# EAGLE schematic Flash2Verify_v1.0 (EAGLE 6.4)
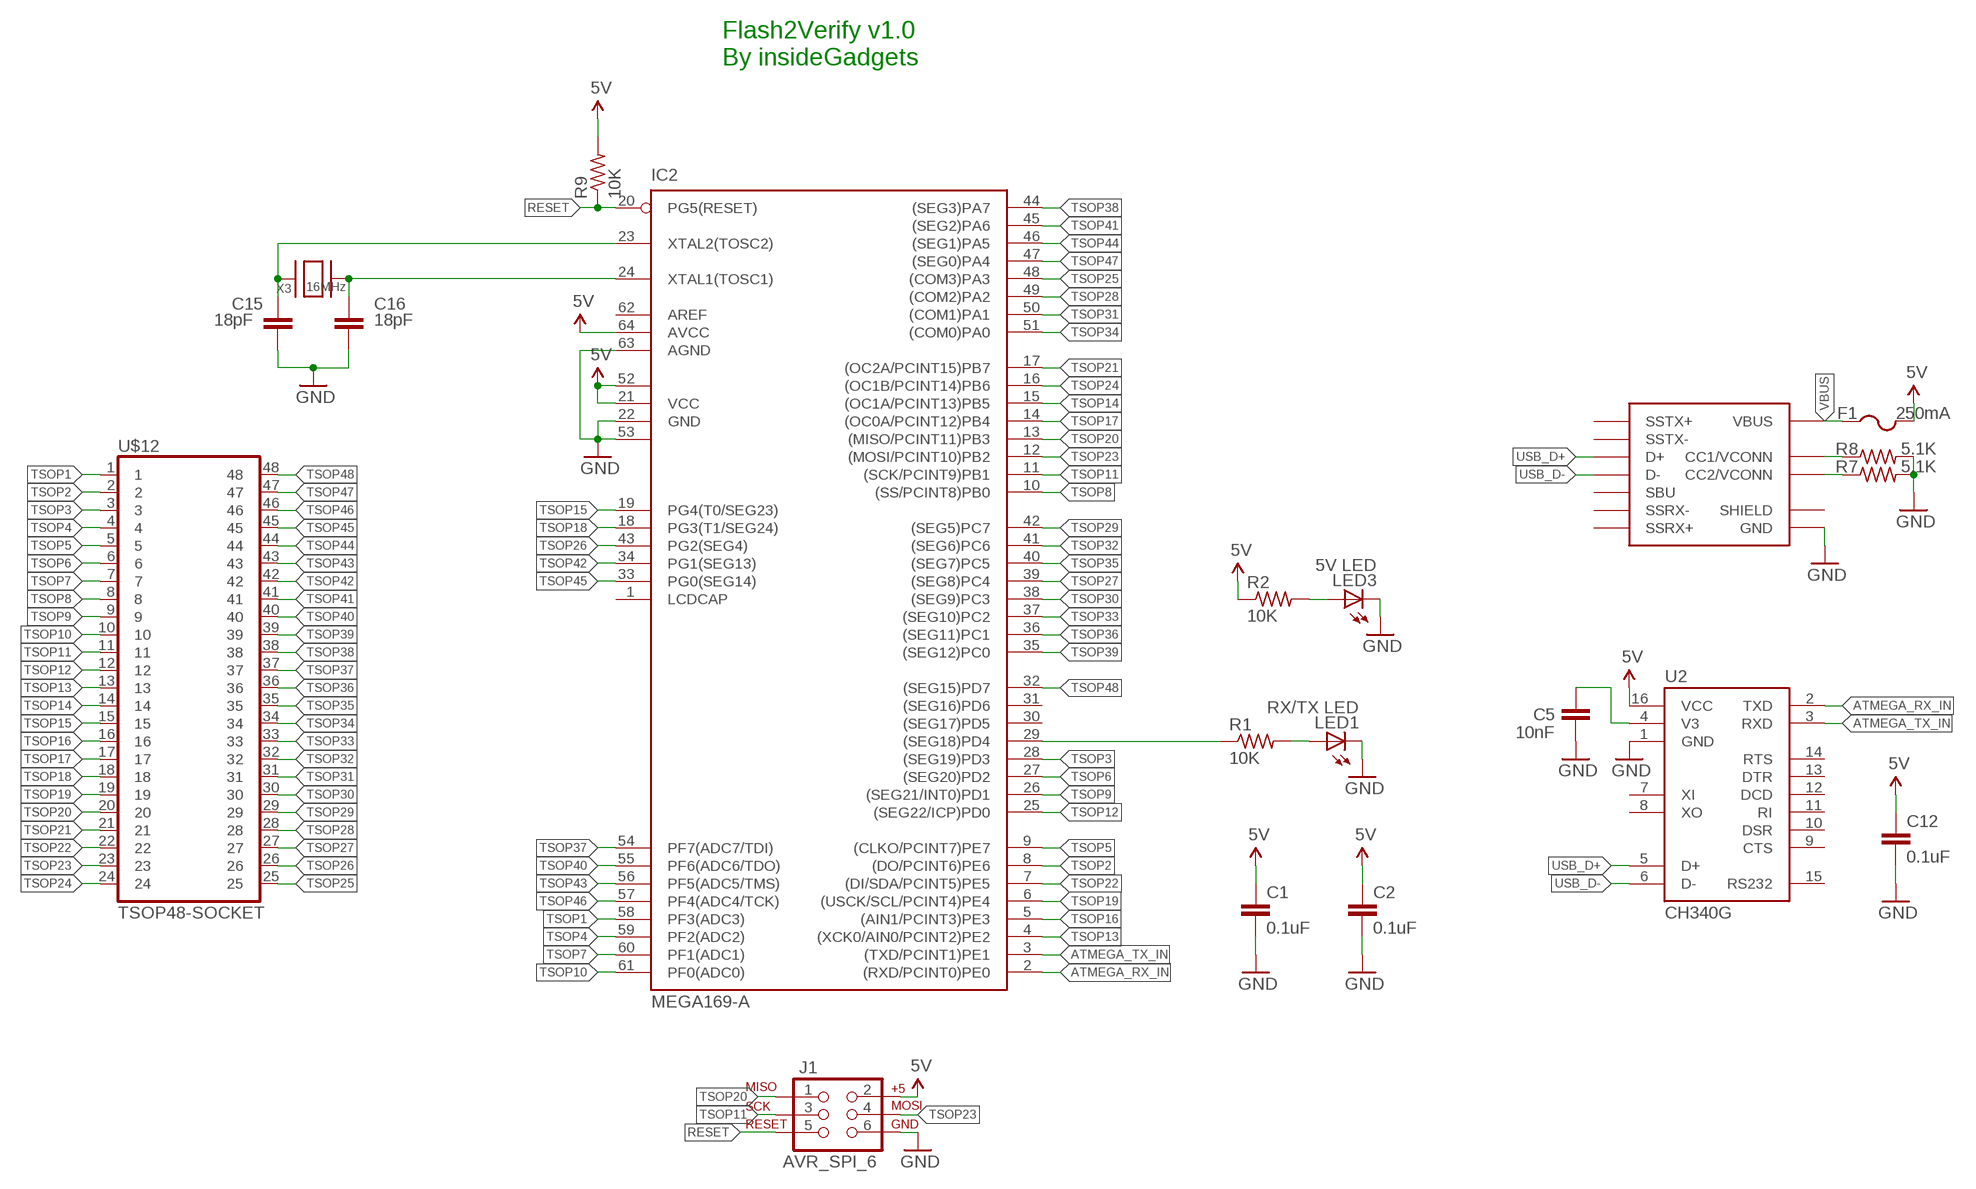
[diagram p0: schematic, sheet 1]

## Parts
C1  0.1uF  CAP0805  [C0805K]
C2  0.1uF  CAP0805  [C0805K]
C5  10nF  CAP0805  [C0805K]
C12  0.1uF  CAP0805  [C0805K]
C15  18pF  CAP0603  [C0603K]
C16  18pF  CAP0603  [C0603K]
F1  250mA  PTCFUSE-1206  [R1206]
IC2  MEGA169-A  [TQFP64]
J1  AVR_SPI_6  AVR_SPI_PRG_6  [2X3_2]
LED1  RX/TX LED  LEDCHIP-LED0805-NS  [CHIP-LED0805-NS]
LED3  5V LED  LEDCHIP-LED0805-NS  [CHIP-LED0805-NS]
R1  10K  R-US_R0805_2  [R0805_2]
R2  10K  R-US_R0805_2  [R0805_2]
R7  5.1K  R-US_R0805_2  [R0805_2]
R8  5.1K  R-US_R0805_2  [R0805_2]
R9  10K  R-US_R0805_2  [R0805_2]
U2  CH340G  [SO16]
U$3  USB-TYPE-CC393939  [USB-TYPE-C-C393939]
U$12  TSOP48-SOCKET  [TSOP48-SOCKET]
X3  16MHz  XTAL3.2X2.5  [XTAL32-25]

## Nets
5V: C1.1 C2.1 C12.1 F1.2 IC2.21(VCC) IC2.52(VCC1) IC2.64(AVCC) J1.2 R2.1 R9.2 U2.16(VCC)
ATMEGA_RX_IN: IC2.2((RXD/PCINT0)PE0) U2.2(TXD)
ATMEGA_TX_IN: IC2.3((TXD/PCINT1)PE1) U2.3(RXD)
GND: C1.2 C2.2 C5.2 C12.2 C15.2 C16.2 IC2.22(GND) IC2.53(GND1) IC2.63(AGND) J1.6 LED1.C LED3.C R7.2 R8.2 U2.1(GND) U$3.1(GND) U$3.12(GND)
N$1: R7.1 U$3.10(CC2/VCONN)
N$2: IC2.29((SEG18)PD4) R1.1
N$5: LED3.A R2.2
N$7: R8.1 U$3.4(CC1/VCONN)
N$18: LED1.A R1.2
RESET: IC2.20(PG5(RESET)) J1.5 R9.1
TSOP1: IC2.58(PF3(ADC3)) U$12.1
TSOP2: IC2.8((DO/PCINT6)PE6) U$12.2
TSOP3: IC2.28((SEG19)PD3) U$12.3
TSOP4: IC2.59(PF2(ADC2)) U$12.4
TSOP5: IC2.9((CLKO/PCINT7)PE7) U$12.5
TSOP6: IC2.27((SEG20)PD2) U$12.6
TSOP7: IC2.60(PF1(ADC1)) U$12.7
TSOP8: IC2.10((SS/PCINT8)PB0) U$12.8
TSOP9: IC2.26((SEG21/INT0)PD1) U$12.9
TSOP10: IC2.61(PF0(ADC0)) U$12.10
TSOP11: IC2.11((SCK/PCINT9)PB1) J1.3 U$12.11
TSOP12: IC2.25((SEG22/ICP)PD0) U$12.12
TSOP13: IC2.4((XCK0/AIN0/PCINT2)PE2) U$12.13
TSOP14: IC2.15((OC1A/PCINT13)PB5) U$12.14
TSOP15: IC2.19(PG4(T0/SEG23)) U$12.15
TSOP16: IC2.5((AIN1/PCINT3)PE3) U$12.16
TSOP17: IC2.14((OC0A/PCINT12)PB4) U$12.17
TSOP18: IC2.18(PG3(T1/SEG24)) U$12.18
TSOP19: IC2.6((USCK/SCL/PCINT4)PE4) U$12.19
TSOP20: IC2.13((MISO/PCINT11)PB3) J1.1 U$12.20
TSOP21: IC2.17((OC2A/PCINT15)PB7) U$12.21
TSOP22: IC2.7((DI/SDA/PCINT5)PE5) U$12.22
TSOP23: IC2.12((MOSI/PCINT10)PB2) J1.4 U$12.23
TSOP24: IC2.16((OC1B/PCINT14)PB6) U$12.24
TSOP25: IC2.48((COM3)PA3) U$12.25
TSOP26: IC2.43(PG2(SEG4)) U$12.26
TSOP27: IC2.39((SEG8)PC4) U$12.27
TSOP28: IC2.49((COM2)PA2) U$12.28
TSOP29: IC2.42((SEG5)PC7) U$12.29
TSOP30: IC2.38((SEG9)PC3) U$12.30
TSOP31: IC2.50((COM1)PA1) U$12.31
TSOP32: IC2.41((SEG6)PC6) U$12.32
TSOP33: IC2.37((SEG10)PC2) U$12.33
TSOP34: IC2.51((COM0)PA0) U$12.34
TSOP35: IC2.40((SEG7)PC5) U$12.35
TSOP36: IC2.36((SEG11)PC1) U$12.36
TSOP37: IC2.54(PF7(ADC7/TDI)) U$12.37
TSOP38: IC2.44((SEG3)PA7) U$12.38
TSOP39: IC2.35((SEG12)PC0) U$12.39
TSOP40: IC2.55(PF6(ADC6/TDO)) U$12.40
TSOP41: IC2.45((SEG2)PA6) U$12.41
TSOP42: IC2.34(PG1(SEG13)) U$12.42
TSOP43: IC2.56(PF5(ADC5/TMS)) U$12.43
TSOP44: IC2.46((SEG1)PA5) U$12.44
TSOP45: IC2.33(PG0(SEG14)) U$12.45
TSOP46: IC2.57(PF4(ADC4/TCK)) U$12.46
TSOP47: IC2.47((SEG0)PA4) U$12.47
TSOP48: IC2.32((SEG15)PD7) U$12.48
USB_D+: U2.5(D+) U$3.6(D+) U$3.8(D+)
USB_D-: U2.6(D-) U$3.5(D-) U$3.7(D-)
V3: C5.1 U2.4(V3)
VBUS: F1.1 U$3.2(VBUS) U$3.11(VBUS)
XTAL1: C16.1 IC2.24(XTAL1(TOSC1)) X3.2
XTAL2: C15.1 IC2.23(XTAL2(TOSC2)) X3.1
Unconnected: IC2.1(LCDCAP) IC2.30((SEG17)PD5) IC2.31((SEG16)PD6) IC2.62(AREF) U2.7(XI) U2.8(XO) U2.9(CTS) U2.10(DSR) U2.11(RI) U2.12(DCD) U2.13(DTR) U2.14(RTS) U2.15(RS232) U$3.3(SBU) U$3.9(SBU) U$3.P$1(SHIELD) U$3.P$2(SSRX+) U$3.P$3(SSRX-) U$3.P$4(SSTX+) U$3.P$5(SSTX-)

## Notes on the sheet
- Flash2Verify v1.0
  By insideGadgets

## Library data of the parts
C1 C2 C5 C12 C15 C16 = adafruit:CAP
F1 = adafruit:PTCFUSE: PTC fuses, resettable thermistors
IC2 = avr-5:MEGA169: MICROCONTROLLER 16 Kbytes FLASH 1 Kbytes SRAM 512 bytes EEPROM USART 8-channel 10 bit ADC 4x25 Segment LCD Driver
J1 = SparkFun:AVR_SPI_PRG_6: AVR ISP 6 Pin This is the reduced ISP connector for AVR programming. Common on Arduino. This footprint will take up less PCB space and can be used with a 10-pin to 6-pin adapter such as SKU: BOB-08508
LED1 LED3 = adafruit:LED: LED OSRAM: - CHIPLED LG R971, LG N971, LY N971, LG Q971, LY Q971, LO R971, LY R971 LH N974, LH R974 LS Q976, LO Q976, LY Q976 LO Q996 - Hyper CHIPLED LW Q18S LB Q993, LB Q99A, LB R99A - SideLED LS A670, LO A670, LY A670, LG A670, LP A670 LB A673, LV A673, LT A673, LW A673 LH A674 LY A675 LS A676, LA A676, LO A676, LY A676, LW A676 LS A679, LY A679, LG A679 - Hyper Micro SIDELED® LS Y876, LA Y876, LO Y876, LY Y876 LT Y87S - SmartLED LW L88C, LW L88S LB L89C, LB L89S, LG L890 LS L89K, LO L89K, LY L89K LS L896, LA L896, LO L896, LY L896 - TOPLED LS T670, LO T670, LY T670, LG T670, LP T670 LSG T670, LSP T670, LSY T670, LOP T670, LYG T670 LG T671, LOG T671, LSG T671 LB T673, LV T673, LT T673, LW T673 LH T674 LS T676, LA T676, LO T676, LY T676, LB T676, LH T676, LSB T676, LW T676 LB T67C, LV T67C, LT T67C, LS T67K, LO T67K, LY T67K, LW E67C LS E67B, LA E67B, LO E67B, LY E67B, LB E67C, LV E67C, LT E67C LW T67C LS T679, LY T679, LG T679 LS T770, LO T770, LY T770, LG T770, LP T770 LB T773, LV T773, LT T773, LW T773 LH T774 LS E675, LA E675, LY E675, LS T675 LS T776, LA T776, LO T776, LY T776, LB T776 LHGB T686 LT T68C, LB T68C - Hyper Mini TOPLED® LB M676 - Mini TOPLED Santana® LG M470 LS M47K, LO M47K, LY M47K Source: http://www.osram.convergy.de/
R1 R2 R7-R9 = adafruit:R-US_: RESISTOR, American symbol
U2 = alex:CH340G
U$3 = lio:USB-TYPE-C
U$12 = am29-memory:TSOP48-SOCKET
X3 = adafruit:XTAL: Low cost SMT crystals, no capacitors included http://www.ladyada.net/library/eagle